# Altium schematic sheet Peripherals.SchDoc
size A3
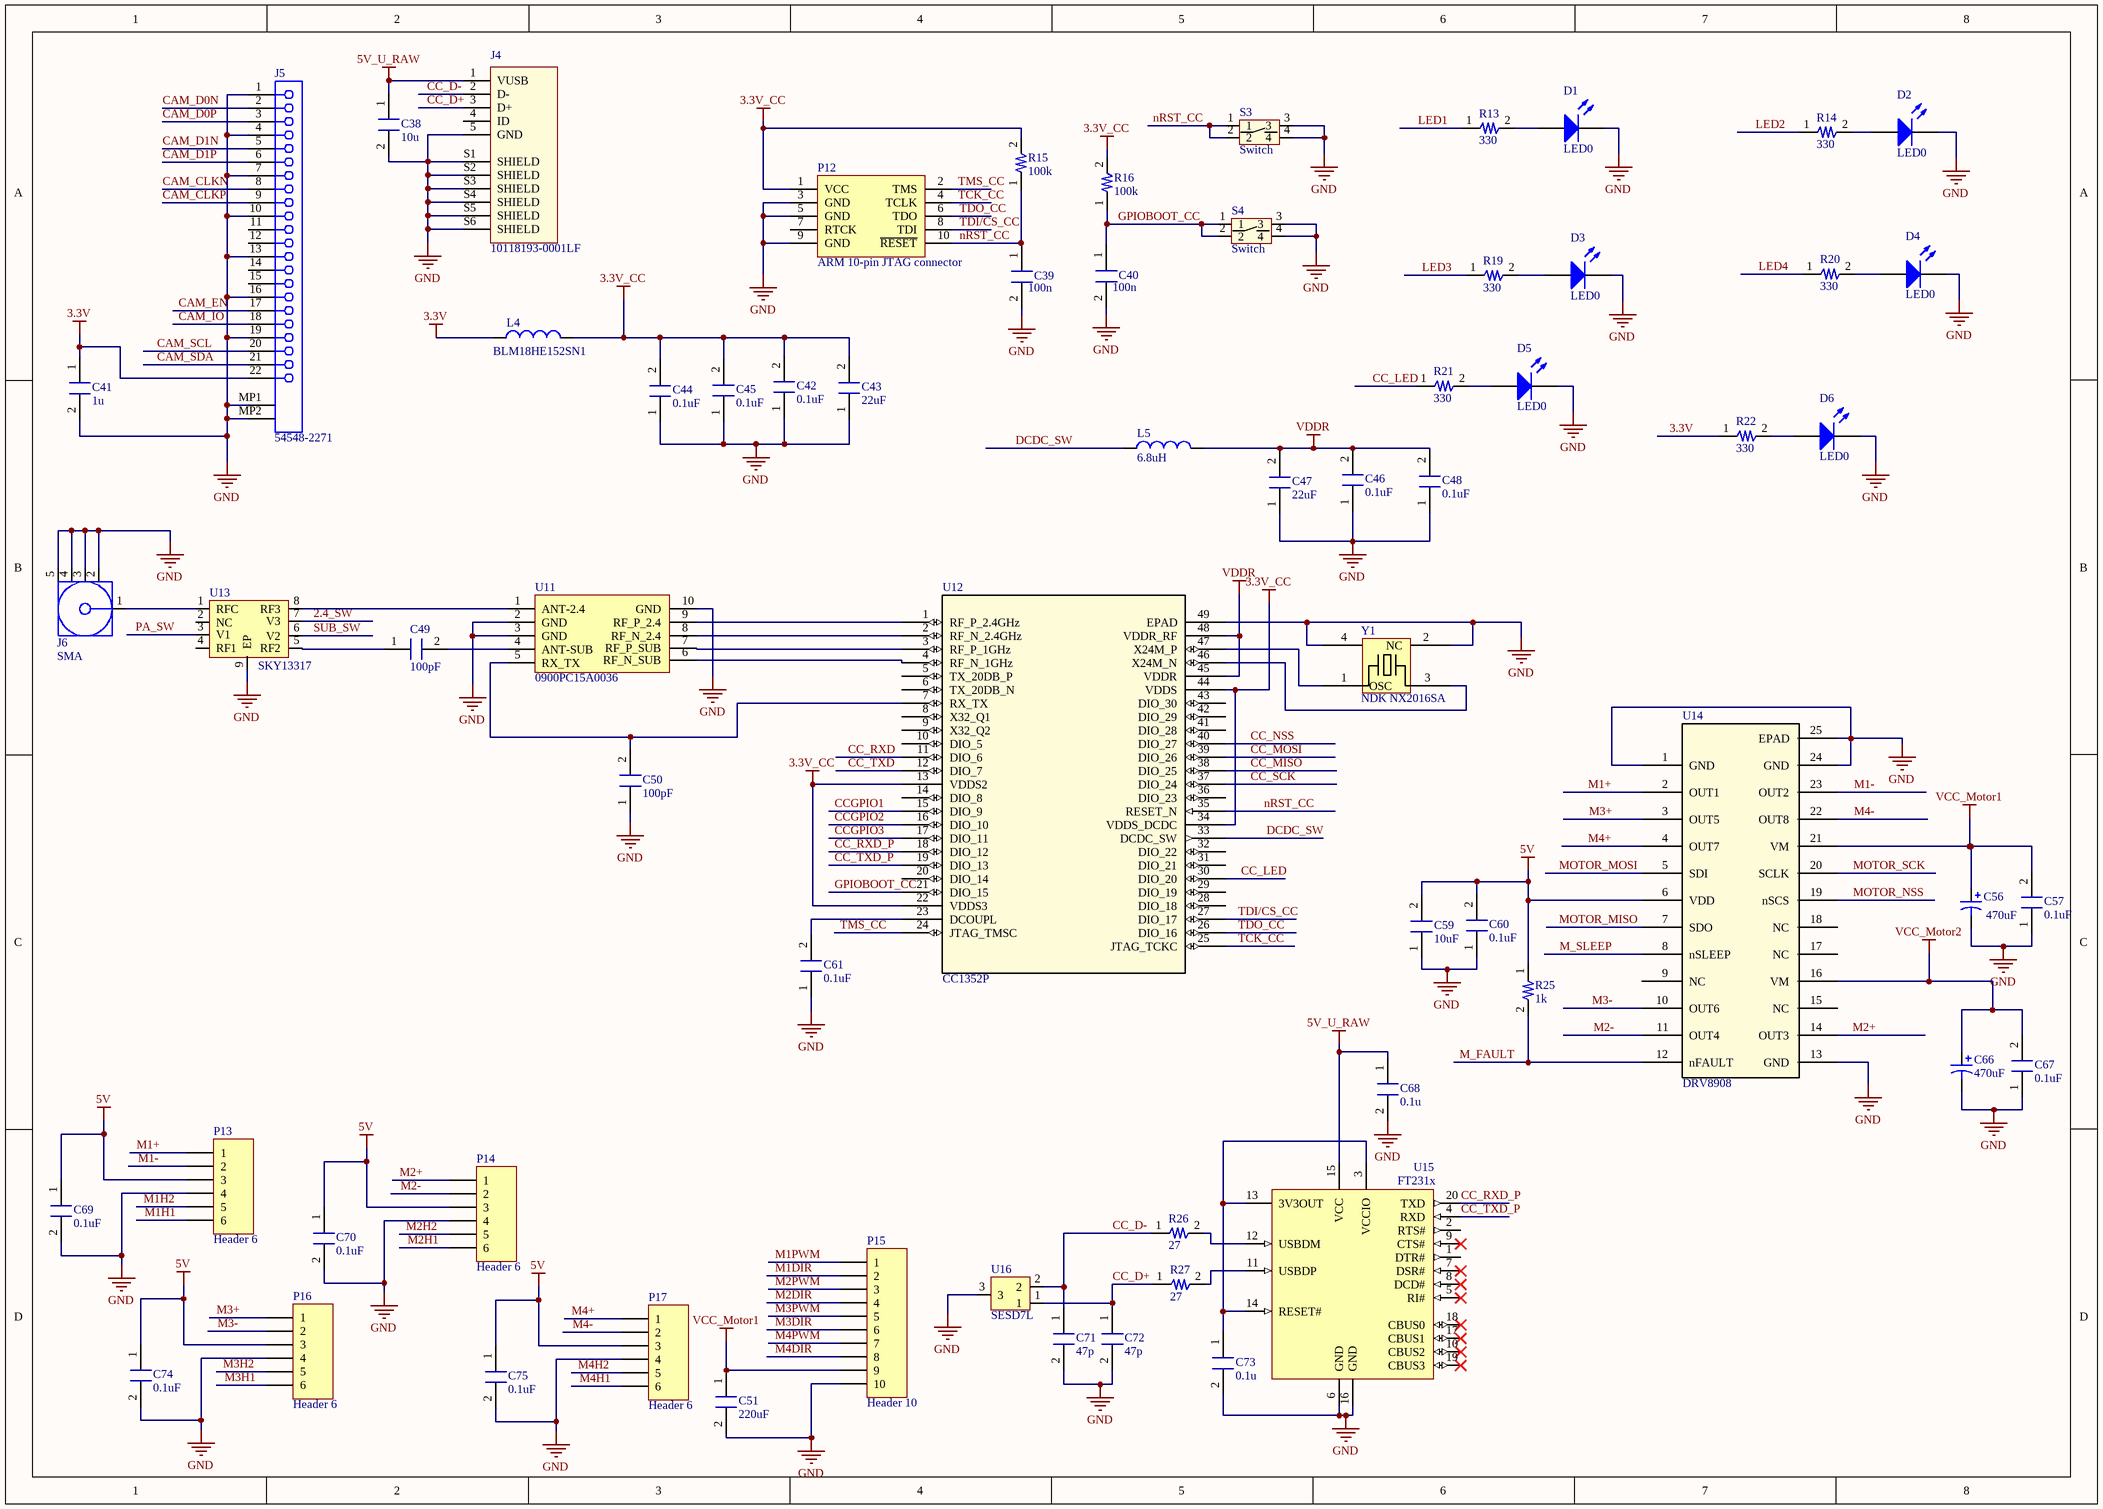
[diagram p0: Peripherals.SchDoc]

## Parts
C38  value 10u  [Capacitor 0603]  (hidden comment: Ceramic Capacitor)
C39  value 100n  [Capacitor 0402]  (hidden comment: Ceramic Capacitor)
C40  value 100n  [Capacitor 0402]  (hidden comment: Ceramic Capacitor)
C41  value 1u  [Capacitor 0402]  (hidden comment: Ceramic Capacitor)
C42  value 0.1uF  [Capacitor 0402]  (hidden comment: Ceramic Capacitor)
C43  value 22uF  [Capacitor 0603]  (hidden comment: Ceramic Capacitor)
C44  value 0.1uF  [Capacitor 0402]  (hidden comment: Ceramic Capacitor)
C45  value 0.1uF  [Capacitor 0402]  (hidden comment: Ceramic Capacitor)
C46  value 0.1uF  [Capacitor 0402]  (hidden comment: Ceramic Capacitor)
C47  value 22uF  [Capacitor 0603]  (hidden comment: Ceramic Capacitor)
C48  value 0.1uF  [Capacitor 0402]  (hidden comment: Ceramic Capacitor)
C49  value 100pF  [Capacitor 0402]  (hidden comment: Ceramic Capacitor)
C50  value 100pF  [Capacitor 0402]  (hidden comment: Ceramic Capacitor)
C51  value 220uF  [CAPAE250P680X1220_VERT]  (hidden comment: Ceramic Capacitor)
C56  470uF  [RB7.6-15]
C57  value 0.1uF  [Capacitor 0402]  (hidden comment: Ceramic Capacitor)
C59  value 10uF  [Capacitor 0603]  (hidden comment: Ceramic Capacitor)
C60  value 0.1uF  [Capacitor 0402]  (hidden comment: Ceramic Capacitor)
C61  value 0.1uF  [Capacitor 0402]  (hidden comment: Ceramic Capacitor)
C66  470uF  [RB7.6-15]
C67  value 0.1uF  [Capacitor 0402]  (hidden comment: Ceramic Capacitor)
C68  value 0.1u  [Capacitor 0402]  (hidden comment: Ceramic Capacitor)
C69  value 0.1uF  [Capacitor 0402]  (hidden comment: Ceramic Capacitor)
C70  value 0.1uF  [Capacitor 0402]  (hidden comment: Ceramic Capacitor)
C71  value 47p  [Capacitor 0402]  (hidden comment: Ceramic Capacitor)
C72  value 47p  [Capacitor 0402]  (hidden comment: Ceramic Capacitor)
C73  value 0.1u  [Capacitor 0402]  (hidden comment: Ceramic Capacitor)
C74  value 0.1uF  [Capacitor 0402]  (hidden comment: Ceramic Capacitor)
C75  value 0.1uF  [Capacitor 0402]  (hidden comment: Ceramic Capacitor)
D1  LED0  [HDR1X2]
D2  LED0  [HDR1X2]
D3  LED0  [HDR1X2]
D4  LED0  [HDR1X2]
D5  LED0  [HDR1X2]
D6  LED0  [HDR1X2]
J4  10118193-0001LF  [FCI_10118193-0001LF_10118193-0001LF(Primary)]
J5  54548-2271  [54548-2271]
J6  SMA  [SMA4.75V5A - Straight]
L4  BLM18HE152SN1  [Resistor 0603]
L5  6.8uH  [B82144F2682K000]
P12  ARM 10-pin JTAG connector  [MHDR2X5]
P13  Header 6  [HDR1X6]
P14  Header 6  [HDR1X6]
P15  Header 10  [HDR1X10]
P16  Header 6  [HDR1X6]
P17  Header 6  [HDR1X6]
R13  value 330  [Resistor 0402]  (hidden comment: Resistor)
R14  value 330  [Resistor 0402]  (hidden comment: Resistor)
R15  value 100k  [Resistor 0402]  (hidden comment: Resistor)
R16  value 100k  [Resistor 0402]  (hidden comment: Resistor)
R19  value 330  [Resistor 0402]  (hidden comment: Resistor)
R20  value 330  [Resistor 0402]  (hidden comment: Resistor)
R21  value 330  [Resistor 0402]  (hidden comment: Resistor)
R22  value 330  [Resistor 0402]  (hidden comment: Resistor)
R25  value 1k  [Resistor 0402]  (hidden comment: Resistor)
R26  value 27  [Resistor 0402]  (hidden comment: Resistor)
R27  value 27  [Resistor 0402]  (hidden comment: Resistor)
S3  Switch  [Switch]
S4  Switch  [Switch]
U11  0900PC15A0036  [0900PC15A0036]
U12  CC1352P  [RGZ48]
U13  SKY13317  [DFN-8_DC]
U14  DRV8908  [HTTSOP 24]
U15  FT231x  [SSOP-20_N]
U16  SESD7L  [SOT-723]
Y1  NDK NX2016SA  [NDK NX2016SA]

## Nets
3.3V: C41.1 J5.22 L4.1 R22.1
3.3V_CC: C42.2 C43.2 C44.2 C45.2 L4.2 P12.1(VCC) R15.2 R16.2 U12.13(VDDS2) U12.22(VDDS3) U12.34(VDDS_DCDC) U12.44(VDDS)
5V: C59.2 C60.2 C69.1 C70.1 C74.1 C75.1 P13.3 P14.3 P16.3 P17.3 R25.1 U14.6(VDD)
5V_U_RAW: C38.1 C68.1 J4.1(VUSB) U15.15(VCC)
GND: C38.2 C39.2 C40.2 C41.2 C42.1 C43.1 C44.1 C45.1 C46.1 C47.1 C48.1 C50.1 C51.2 C56.2 C57.1 C59.1 C60.1 C61.1 C66.2 C67.1 C68.2 C69.2 C70.2 C71.2 C72.2 C73.2 C74.2 C75.2 D1.2(K) D2.2(K) D3.2(K) D4.2(K) D5.2(K) D6.2(K) J4.5(GND) J4.S1(SHIELD) J4.S2(SHIELD) J4.S3(SHIELD) J4.S4(SHIELD) J4.S5(SHIELD) J4.S6(SHIELD) J5.1 J5.4 J5.7 J5.10 J5.13 J5.16 J5.19 J5.MP1 J5.MP2 J6.2 J6.3 J6.4 J6.5 P12.3(GND) P12.5(GND) P12.9(GND) P13.4 P14.4 P15.10 P16.4 P17.4 S3.3 S3.4 S4.3 S4.4 U11.2(GND) U11.3(GND) U11.10(GND) U12.49(EPAD) U13.9(EP) U14.1(GND) U14.13(GND) U14.24(GND) U14.25(EPAD) U15.6(GND) U15.16(GND) U16.3 Y1.2(NC) Y1.4(NC)
VCC_Motor1: C51.1 C56.1 C57.2 P15.9 U14.21(VM)
VCC_Motor2: C66.1 C67.2 U14.16(VM)
VDDR: C46.2 C47.2 C48.2 L5.2 U12.45(VDDR) U12.48(VDDR_RF)
2.4_SW: U13.7(V3)
CAM_CLKN: J5.8
CAM_CLKP: J5.9
CAM_D0N: J5.2
CAM_D0P: J5.3
CAM_D1N: J5.5
CAM_D1P: J5.6
CAM_EN: J5.17
CAM_IO: J5.18
CAM_SCL: J5.20
CAM_SDA: J5.21
CC_D+: C72.1 J4.3(D+) R27.1 U16.1
CC_D-: C71.1 J4.2(D-) R26.1 U16.2
CC_LED: R21.1 U12.30(DIO_20)
CC_MISO: U12.38(DIO_25)
CC_MOSI: U12.39(DIO_26)
CC_NSS: U12.40(DIO_27)
CC_RXD: U12.11(DIO_6)
CC_RXD_P: U12.18(DIO_12) U15.20(TXD)
CC_SCK: U12.37(DIO_24)
CC_TXD: U12.12(DIO_7)
CC_TXD_P: U12.19(DIO_13) U15.4(RXD)
CCGPIO1: U12.15(DIO_9)
CCGPIO2: U12.16(DIO_10)
CCGPIO3: U12.17(DIO_11)
DCDC_SW: L5.1 U12.33(DCDC_SW)
GPIOBOOT_CC: C40.1 R16.1 S4.1 S4.2 U12.21(DIO_15)
LED1: R13.1
LED2: R14.1
LED3: R19.1
LED4: R20.1
M1+: P13.1 U14.2(OUT1)
M1-: P13.2 U14.23(OUT2)
M1DIR: P15.2
M1H1: P13.6
M1H2: P13.5
M1PWM: P15.1
M2+: P14.1 U14.14(OUT3)
M2-: P14.2 U14.11(OUT4)
M2DIR: P15.4
M2H1: P14.6
M2H2: P14.5
M2PWM: P15.3
M3+: P16.1 U14.3(OUT5)
M3-: P16.2 U14.10(OUT6)
M3DIR: P15.6
M3H1: P16.6
M3H2: P16.5
M3PWM: P15.5
M4+: P17.1 U14.4(OUT7)
M4-: P17.2 U14.22(OUT8)
M4DIR: P15.8
M4H1: P17.6
M4H2: P17.5
M4PWM: P15.7
M_FAULT: R25.2 U14.12(nFAULT)
M_SLEEP: U14.8(nSLEEP)
MOTOR_MISO: U14.7(SDO)
MOTOR_MOSI: U14.5(SDI)
MOTOR_NSS: U14.19(nSCS)
MOTOR_SCK: U14.20(SCLK)
nRST_CC: C39.1 P12.10(~{RESET}) R15.1 S3.1 S3.2 U12.35(RESET_N)
PA_SW: U13.3(V1)
SUB_SW: U13.6(V2)
TCK_CC: P12.4(TCLK) U12.25(JTAG_TCKC)
TDI/CS_CC: P12.8(TDI) U12.27(DIO_17)
TDO_CC: P12.6(TDO) U12.26(DIO_16)
TMS_CC: P12.2(TMS) U12.24(JTAG_TMSC)
NetC49_1: C49.1 U13.5(RF2)
NetC49_2: C49.2 U11.4(ANT-SUB)
NetC50_2: C50.2 U11.5(RX_TX) U12.7(RX_TX)
NetC61_2: C61.2 U12.23(DCOUPL)
NetC73_1: C73.1 U15.3(VCCIO) U15.13(3V3OUT) U15.14(RESET#)
NetD1_1: D1.1(A) R13.2
NetD2_1: D2.1(A) R14.2
NetD3_1: D3.1(A) R19.2
NetD4_1: D4.1(A) R20.2
NetD5_1: D5.1(A) R21.2
NetD6_1: D6.1(A) R22.2
NetJ6_1: J6.1 U13.1(RFC)
NetR26_2: R26.2 U15.12(USBDM)
NetR27_2: R27.2 U15.11(USBDP)
NetU11_1: U11.1(ANT-2.4) U13.8(RF3)
NetU11_6: U11.6(RF_N_SUB) U12.4(RF_N_1GHz)
NetU11_7: U11.7(RF_P_SUB) U12.3(RF_P_1GHz)
NetU11_8: U11.8(RF_N_2.4) U12.2(RF_N_2.4GHz)
NetU11_9: U11.9(RF_P_2.4) U12.1(RF_P_2.4GHz)
NetU12_46: U12.46(X24M_N) Y1.3(OSC)
NetU12_47: U12.47(X24M_P) Y1.1(OSC)

Not connected (* = marked no-connect by the designer): J4 4(ID); J5 11 12 14 15; P12 7(RTCK); U12 5(TX_20DB_P) 6(TX_20DB_N) 8(X32_Q1) 9(X32_Q2) 10(DIO_5) 14(DIO_8) 20(DIO_14) 28(DIO_18) 29(DIO_19) 31(DIO_21) 32(DIO_22) 36(DIO_23) 41(DIO_28) 42(DIO_29) 43(DIO_30); U13 2(NC) 4(RF1); U14 9(NC) 15(NC) 17(NC) 18(NC); U15 1(DTR#) 2(RTS#) 5(RI#)* 7(DSR#)* 8(DCD#)* 9(CTS#)* 10(CBUS2)* 17(CBUS1)* 18(CBUS0)* 19(CBUS3)*

## Library data of the parts
C56 C66 = Cap Pol1: Polarized Capacitor (Radial); Published: 8-Jun-2000; LatestRevisionDate: 17-Jul-2002; LatestRevisionNote: Re-released for DXP Platform.; PackageReference: RB7.6-15; Publisher: Altium Limited; PackageDescription: Polarized Capacitor (Radial); 2 Leads
D1-D6 = LED0: Typical INFRARED GaAs LED; Published: 8-Jun-2000; LatestRevisionDate: 08-Jul-2005; LatestRevisionNote: Mech Layer 1 removed.; PackageReference: LED-0; Publisher: Altium Limited; PackageDescription: LED; 2 Leads
J4 = USB mini 10118193-0001LF: USB mini; Digikey: *
L4 L5 = Inductor
  L4: Value: BLM18HE152SN1
  L5: Part number: B82144F2682K000
P12 = ARM JTAG: ARM JTAG/SWD connector; Farnell Code: 1865279
P13 P14 P16 P17 = Header 6: Header, 6-Pin; LatestRevisionDate: 17-Jul-2002; LatestRevisionNote: Re-released for DXP Platform.; Publisher: Altium Limited
P15 = Header 10: Header, 10-Pin; LatestRevisionDate: 17-Jul-2002; LatestRevisionNote: Re-released for DXP Platform.; Publisher: Altium Limited
R13-R16 R19-R22 R25-R27 = Resistor: General Purpose Resistor
  R13-R16 R19-R22 R25: Digikey: *
  R26 R27: Digikey: P27DDCT-ND
U12 = CC1352P: No Description Available
U14 = DRV8908: No Description Available
U16 = SESD7L: TVS Diode - USB
C38-C51 C57 C59-C61 C67-C75 = Ceramic Capacitor
  C38-C51 C57 C59-C61 C67-C70 C73-C75: Digikey: *
  C71 C72: Digikey: 445-5592-1-ND
U15 = FT231x: Digikey: 768-1129-1-ND